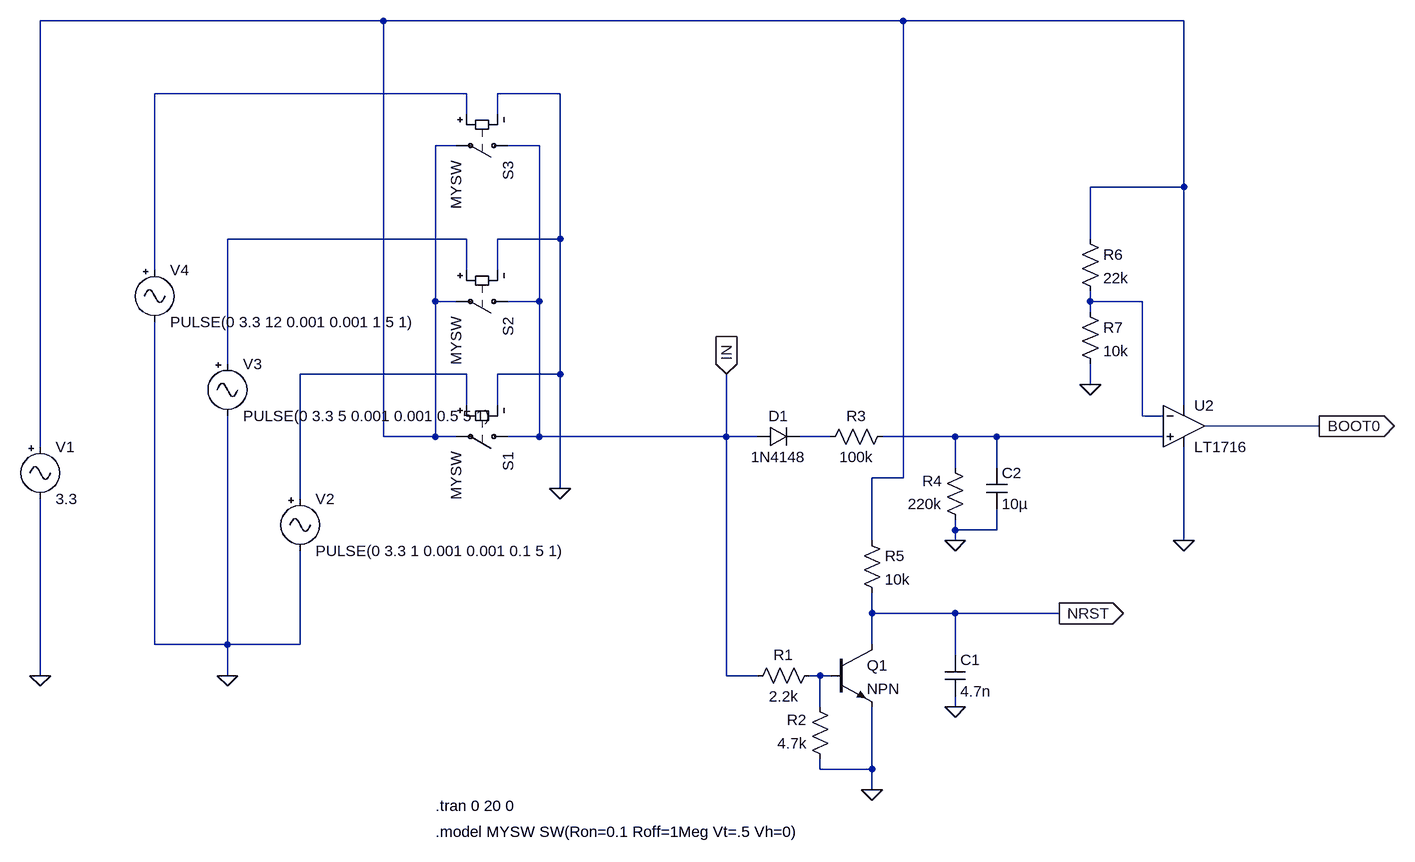
[diagram p0: schematic reset_circuit_v02.asc]
reset_circuit_v02.asc, the LTspice schematic file:
Version 4
SHEET 1 1564 680
WIRE -16 -752 -544 -752
WIRE 784 -752 -16 -752
WIRE 1216 -752 784 -752
WIRE 112 -640 -368 -640
WIRE 256 -640 160 -640
WIRE 112 -608 112 -640
WIRE 160 -608 160 -640
WIRE 96 -560 64 -560
WIRE 224 -560 176 -560
WIRE 1216 -496 1216 -752
WIRE 1216 -496 1072 -496
WIRE 112 -416 -256 -416
WIRE 256 -416 256 -640
WIRE 256 -416 160 -416
WIRE 1072 -416 1072 -496
WIRE -368 -368 -368 -640
WIRE 112 -368 112 -416
WIRE 160 -368 160 -416
WIRE 64 -320 64 -560
WIRE 96 -320 64 -320
WIRE 224 -320 224 -560
WIRE 224 -320 176 -320
WIRE 1072 -320 1072 -336
WIRE 1152 -320 1072 -320
WIRE 1072 -304 1072 -320
WIRE -256 -224 -256 -416
WIRE 112 -208 -144 -208
WIRE 256 -208 256 -416
WIRE 256 -208 160 -208
WIRE 1072 -192 1072 -224
WIRE 112 -160 112 -208
WIRE 160 -160 160 -208
WIRE 1216 -160 1216 -496
WIRE 1152 -144 1152 -320
WIRE 1184 -144 1152 -144
WIRE 1424 -128 1248 -128
WIRE -16 -112 -16 -752
WIRE 64 -112 64 -320
WIRE 64 -112 -16 -112
WIRE 96 -112 64 -112
WIRE 224 -112 224 -320
WIRE 224 -112 176 -112
WIRE 512 -112 512 -208
WIRE 512 -112 224 -112
WIRE 560 -112 512 -112
WIRE 672 -112 624 -112
WIRE 864 -112 752 -112
WIRE 928 -112 864 -112
WIRE 1184 -112 928 -112
WIRE -544 -96 -544 -752
WIRE 864 -64 864 -112
WIRE 928 -64 928 -112
WIRE 784 -48 784 -752
WIRE 784 -48 736 -48
WIRE 256 -32 256 -208
WIRE -144 -16 -144 -208
WIRE 864 32 864 16
WIRE 928 32 928 0
WIRE 928 32 864 32
WIRE 736 48 736 -48
WIRE 864 48 864 32
WIRE 1216 48 1216 -96
WIRE 736 160 736 128
WIRE 864 160 736 160
WIRE 1024 160 864 160
WIRE -368 208 -368 -288
WIRE -256 208 -256 -144
WIRE -256 208 -368 208
WIRE -144 208 -144 64
WIRE -144 208 -256 208
WIRE 736 208 736 160
WIRE 864 224 864 160
WIRE -544 256 -544 -16
WIRE -256 256 -256 208
WIRE 512 256 512 -112
WIRE 560 256 512 256
WIRE 656 256 640 256
WIRE 672 256 656 256
WIRE 656 304 656 256
WIRE 864 304 864 288
WIRE 656 400 656 384
WIRE 736 400 736 304
WIRE 736 400 656 400
WIRE 736 432 736 400
FLAG 736 432 0
FLAG 864 304 0
FLAG 1024 160 NRST
IOPIN 1024 160 Out
FLAG 864 48 0
FLAG 512 -208 IN
IOPIN 512 -208 In
FLAG 256 -32 0
FLAG 1216 48 0
FLAG 1424 -128 BOOT0
IOPIN 1424 -128 Out
FLAG 1072 -192 0
FLAG -256 256 0
FLAG -544 256 0
SYMBOL diode 560 -96 R270
WINDOW 0 32 32 VTop 2
WINDOW 3 0 32 VBottom 2
SYMATTR InstName D1
SYMATTR Value 1N4148
SYMBOL npn 672 208 R0
SYMATTR InstName Q1
SYMBOL res 656 240 R90
WINDOW 0 0 56 VBottom 2
WINDOW 3 32 56 VTop 2
SYMATTR InstName R1
SYMATTR Value 2.2k
SYMBOL res 672 400 R180
WINDOW 0 36 76 Left 2
WINDOW 3 36 40 Left 2
SYMATTR InstName R2
SYMATTR Value 4.7k
SYMBOL cap 848 224 R0
SYMATTR InstName C1
SYMATTR Value 4.7n
SYMBOL res 768 -128 R90
WINDOW 0 0 56 VBottom 2
WINDOW 3 32 56 VTop 2
SYMATTR InstName R3
SYMATTR Value 100k
SYMBOL res 880 32 R180
WINDOW 0 36 76 Left 2
WINDOW 3 36 40 Left 2
SYMATTR InstName R4
SYMATTR Value 220k
SYMBOL cap 912 -64 R0
SYMATTR InstName C2
SYMATTR Value 10µ
SYMBOL Misc\\signal -544 -112 R0
WINDOW 123 0 0 Left 0
WINDOW 39 0 0 Left 0
SYMATTR InstName V1
SYMATTR Value 3.3
SYMBOL sw 192 -112 R90
SYMATTR InstName S1
SYMATTR Value MYSW
SYMBOL sw 192 -320 R90
SYMATTR InstName S2
SYMATTR Value MYSW
SYMBOL Misc\\signal -144 -32 R0
WINDOW 123 0 0 Left 0
WINDOW 39 0 0 Left 0
SYMATTR InstName V2
SYMATTR Value PULSE(0 3.3 1 0.001 0.001 0.1 5 1)
SYMBOL Misc\\signal -256 -240 R0
WINDOW 123 0 0 Left 0
WINDOW 39 0 0 Left 0
SYMATTR InstName V3
SYMATTR Value PULSE(0 3.3 5 0.001 0.001 0.5 5 1)
SYMBOL res 720 32 R0
SYMATTR InstName R5
SYMATTR Value 10k
SYMBOL res 1056 -432 R0
SYMATTR InstName R6
SYMATTR Value 22k
SYMBOL res 1056 -320 R0
SYMATTR InstName R7
SYMATTR Value 10k
SYMBOL Comparators\\LT1716 1216 -128 R0
SYMATTR InstName U2
SYMBOL Misc\\signal -368 -384 R0
WINDOW 123 0 0 Left 0
WINDOW 39 0 0 Left 0
SYMATTR InstName V4
SYMATTR Value PULSE(0 3.3 12 0.001 0.001 1 5 1)
SYMBOL sw 192 -560 R90
SYMATTR InstName S3
SYMATTR Value MYSW
TEXT 64 456 Left 2 !.tran 0 20 0
TEXT 64 496 Left 2 !.model MYSW SW(Ron=0.1 Roff=1Meg Vt=.5 Vh=0)

The netlist it stands for:
* reset_circuit_v02.asc
D1 IN N006 1N4148
Q1 NRST N008 0 0 NPN
R1 N008 IN 2.2k
R2 0 N008 4.7k
C1 NRST 0 4.7n
R3 N007 N006 100k
R4 0 N007 220k
C2 N007 0 10µ
V1 N001 0 3.3
S1 IN N001 N005 0 MYSW
S2 IN N001 N003 0 MYSW
V2 N005 0 PULSE(0 3.3 1 0.001 0.001 0.1 5 1)
V3 N003 0 PULSE(0 3.3 5 0.001 0.001 0.5 5 1)
R5 N001 NRST 10k
R6 N001 N004 22k
R7 N004 0 10k
XU2 N007 N004 N001 0 BOOT0 LT1716  ; pins In+ In- V+ V- OUT
V4 N002 0 PULSE(0 3.3 12 0.001 0.001 1 5 1)
S3 IN N001 N002 0 MYSW
.model D D
.lib standard.dio
.model NPN NPN
.model PNP PNP
.lib standard.bjt
.tran 0 20 0
.model MYSW SW(Ron=0.1 Roff=1Meg Vt=.5 Vh=0)
.lib LTC1.lib
.backanno
.end